# Altium schematic sheet Connectors.SchDoc: Connectors
size A4; CompanyName: Green Team Twente; Organization: Green Team Twente; Revision: V1.1; SheetNumber: 9; SheetTotal: 10; Team: 2024; Subsystem: Embedded Systems
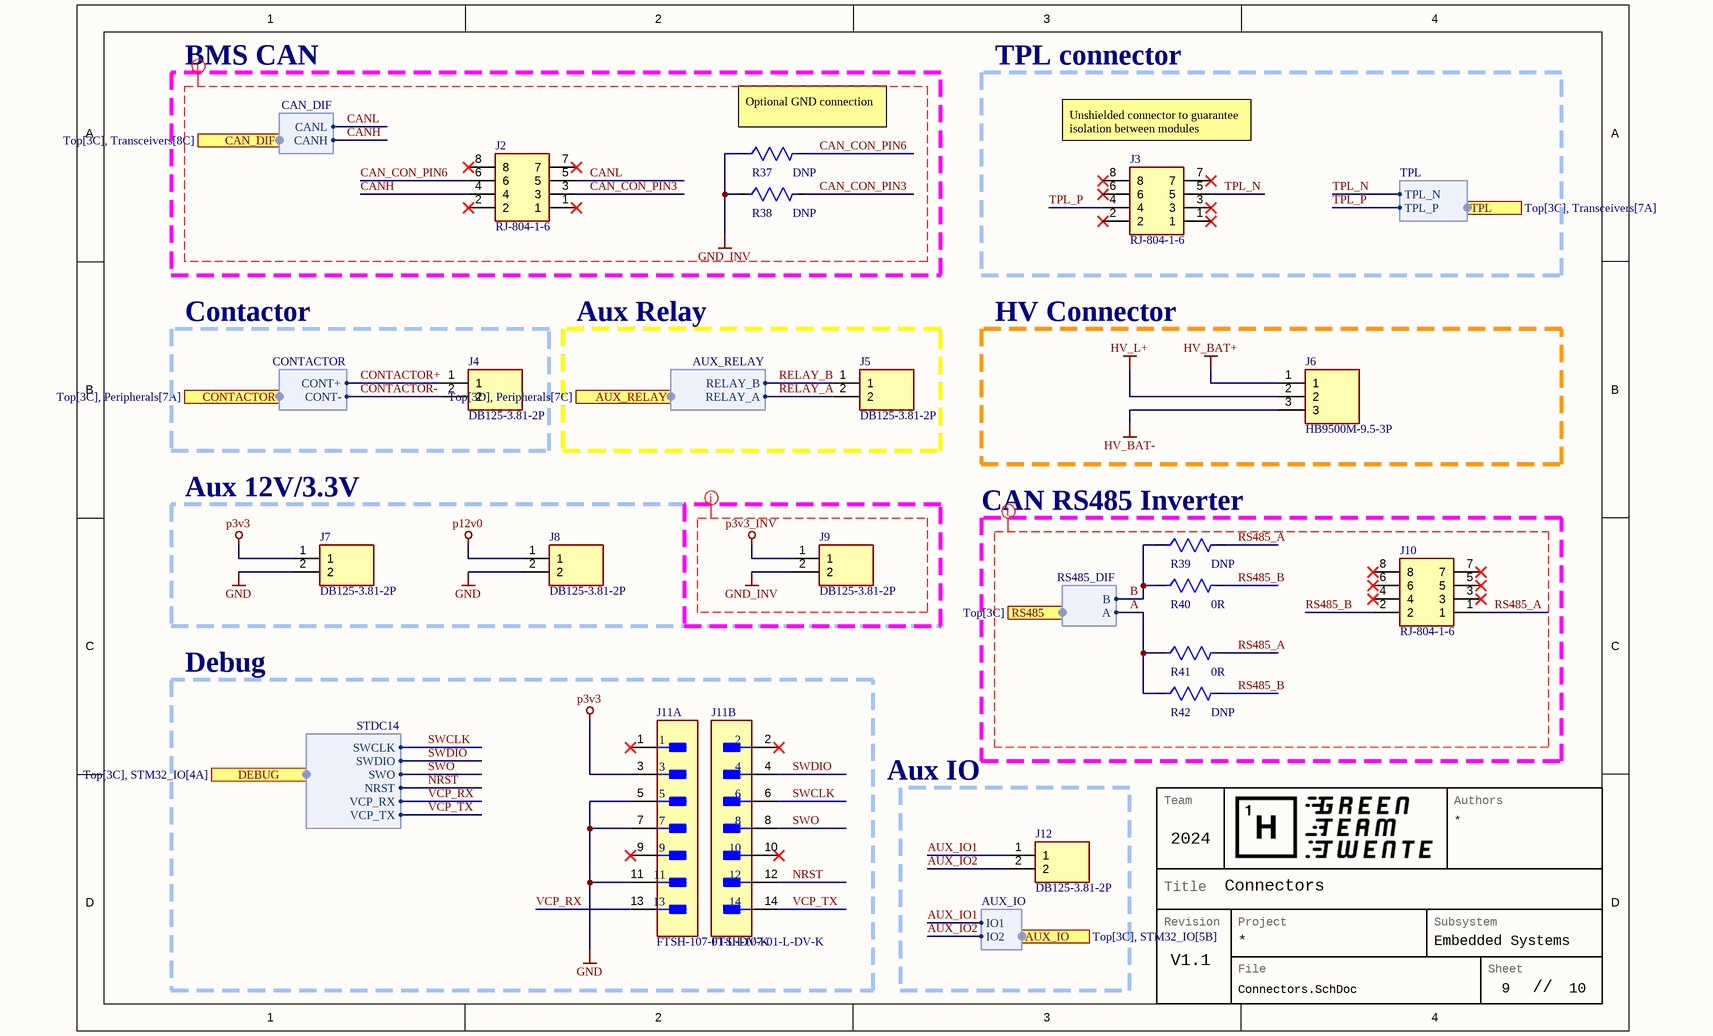
[diagram p0: Connectors.SchDoc]

## Parts
J2  RJ-804-1-6  [RJ80416]
J3  RJ-804-1-6  [RJ80416]
J4  DB125-3.81-2P  [SHDR2W80P0X381_1X2_802X740X880P]
J5  DB125-3.81-2P  [SHDR2W80P0X381_1X2_802X740X880P]
J6  HB9500M-9.5-3P  [HB9500M953P]
J7  DB125-3.81-2P  [SHDR2W80P0X381_1X2_802X740X880P]
J8  DB125-3.81-2P  [SHDR2W80P0X381_1X2_802X740X880P]
J9  DB125-3.81-2P  [SHDR2W80P0X381_1X2_802X740X880P]
J10  RJ-804-1-6  [RJ80416]
J11  FTSH-107-01-L-DV-K  [FP-FTSH-107-01-L-DV-K-MFG]  (parts A,B of 2)
J12  DB125-3.81-2P  [SHDR2W80P0X381_1X2_802X740X880P]
R37  value DNP  [RES_SM1206_YAGEORC_N]  (hidden comment: RES 1206 DNP 1%)
R38  value DNP  [RES_SM1206_YAGEORC_N]  (hidden comment: RES 1206 DNP 1%)
R39  value DNP  [RES_SM1206_YAGEORC_N]  (hidden comment: RES 1206 DNP 1%)  (no BOM)
R40  value 0R  [RES_SM1206_YAGEORC_N]  (hidden comment: RES 1206 0R 1%)
R41  value 0R  [RES_SM1206_YAGEORC_N]  (hidden comment: RES 1206 0R 1%)
R42  value DNP  [RES_SM1206_YAGEORC_N]  (hidden comment: RES 1206 DNP 1%)  (no BOM)

## Blocks framed on the sheet
BMS CAN: J2 R37 R38
TPL connector: J3
Contactor: J4
Aux Relay: J5
HV Connector: J6
Aux 12V/3.3V: J7-J9
CAN RS485 Inverter: J10 R39-R42
Debug: J11

## Ports
AUX_IO (out, harness AUX_IO, see Top[3C], STM32_IO[5B]), AUX_RELAY (out, harness AUX_RELAY, see Top[3D], Peripherals[7C]), CAN_DIF (out, harness CAN_DIF, see Top[3C], Transceivers[8C]), CONTACTOR (out, harness CONTACTOR, see Top[3C], Peripherals[7A]), DEBUG (harness STDC14, see Top[3C], STM32_IO[4A]), RS485 (out, harness RS485_DIF, see Top[3C]), TPL (out, harness TPL, see Top[3C], Transceivers[7A])

## Harnesses
CAN_DIF: CANL, CANH
CONTACTOR: CONT+, CONT-
TPL: TPL_N, TPL_P
STDC14: SWDIO, SWCLK, NRST, SWO, VCP_RX, VCP_TX
RS485_DIF: A, B
AUX_RELAY: RELAY_B, RELAY_A
AUX_IO: IO1, IO2

## Nets
GND: J7.2 J8.2 J11.5 J11.7 J11.11
GND_INV: J9.2 R37.1 R38.1
HV_BAT+: J6.1
HV_BAT-: J6.3
HV_L+: J6.2
p3v3: J7.1 J11.3
p3v3_INV: J9.1
p12v0: J8.1
A: R41.1 R42.1 ; port RS485.A
AUX_IO1: J12.1 ; port AUX_IO.IO1
AUX_IO2: J12.2 ; port AUX_IO.IO2
B: R39.1 R40.1 ; port RS485.B
CAN_CON_PIN3: J2.3 R38.2
CAN_CON_PIN6: J2.6 R37.2
CANH: J2.4 ; port CAN_DIF.CANH
CANL: J2.5 ; port CAN_DIF.CANL
CONTACTOR+: J4.1 ; port CONTACTOR.CONT+
CONTACTOR-: J4.2 ; port CONTACTOR.CONT-
NRST: J11.12 ; port DEBUG.NRST
RELAY_A: J5.2 ; port AUX_RELAY.RELAY_A
RELAY_B: J5.1 ; port AUX_RELAY.RELAY_B
RS485_A: J10.1 R39.2 R41.2
RS485_B: J10.2 R40.2 R42.2
SWCLK: J11.6 ; port DEBUG.SWCLK
SWDIO: J11.4 ; port DEBUG.SWDIO
SWO: J11.8 ; port DEBUG.SWO
TPL_N: J3.5 ; port TPL.TPL_N
TPL_P: J3.4 ; port TPL.TPL_P
VCP_RX: J11.13 ; port DEBUG.VCP_RX
VCP_TX: J11.14 ; port DEBUG.VCP_TX

Not connected (* = marked no-connect by the designer): J2 1* 2* 7* 8*; J3 1* 2* 3* 6* 7* 8*; J10 3* 4* 5* 6* 7* 8*; J11 1* 2* 9* 10*

## Layout directives
net class INV: A, B, CAN_CON_PIN3, CAN_CON_PIN6, CANH, CANL, GND_INV, p3v3_INV, RS485_A, RS485_B

## Notes on the sheet
- (near R37) Optional GND connection
- (near J3) Unshielded connector to guarantee isolation between modules
- Aux IO
- Team
- Authors
- Revision
- Title
- Project
- Subsystem
- File
- Sheet
- //

## Library data of the parts
J2 J3 J10 = RJ-804-1-6: Connector; Manufacturer_Name: FG; Datasheet Link: https://www.lcsc.com/datasheet/lcsc_datasheet_2306211558_FG-RJ-804-1-6_C7205183.pdf; Height: 11.7mm; Manufacturer_Part_Number: RJ-804-1-6
J4 J5 J7-J9 J12 = DB125-3.81-2P: Connector; Manufacturer_Name: Cixi Dibo Electronics Co.,LTD; Datasheet Link: https://datasheet.lcsc.com/szlcsc/1910111742_DIBO-DB125-3-81-2P_C395878.pdf; Height: 8.8mm; Manufacturer_Part_Number: DB125-3.81-2P
J6 = HB9500M-9.5-3P: Connector; Manufacturer_Name: Ningbo Kangnex; Datasheet Link: https://datasheet.lcsc.com/szlcsc/Ningbo-Kangnex-Elec-HB9500-3_C162697.pdf; Height: 13.2mm; Manufacturer_Part_Number: HB9500M-9.5-3P; JLCPCB Part #: C162697
J11 = CMP-02766-001412-1: CONN HEADER SMD 14POS 1.27MM; Number of Contacts: 14; Gender: Male; Termination: Solder; Lead Free: Lead Free; Depth: 5.84mm; Min Operating Temperature: -55°C; Length: 8.89mm; RoHS Compliant: Yes; Housing Material: Polymer; Housing Color: Black; Max Operating Temperature: 125°C; Number of Rows: 2; Pitch: 1.27mm; Radiation Hardening: No; Orientation: Straight; Packaging: Rail/Tube; Contact Material: Bronze; Contact Plating: Gold
R37-R42 = CMP-009-00208-3: GTT Standard 1206 Resistor; Voltage Rating: 50V; Power: 62.5mW; Tolerance: 1%; Case/Package: 1206; Mounting Technology: SMD
  R37-R39 R42: JLCPCB Part #: DNP
  R40 R41: JLCPCB Part #: C17888